# Altium schematic sheet 07_SDDADC.SchDoc
size 420 x 297 mm; SheetNumber: 7; SheetTotal: 12
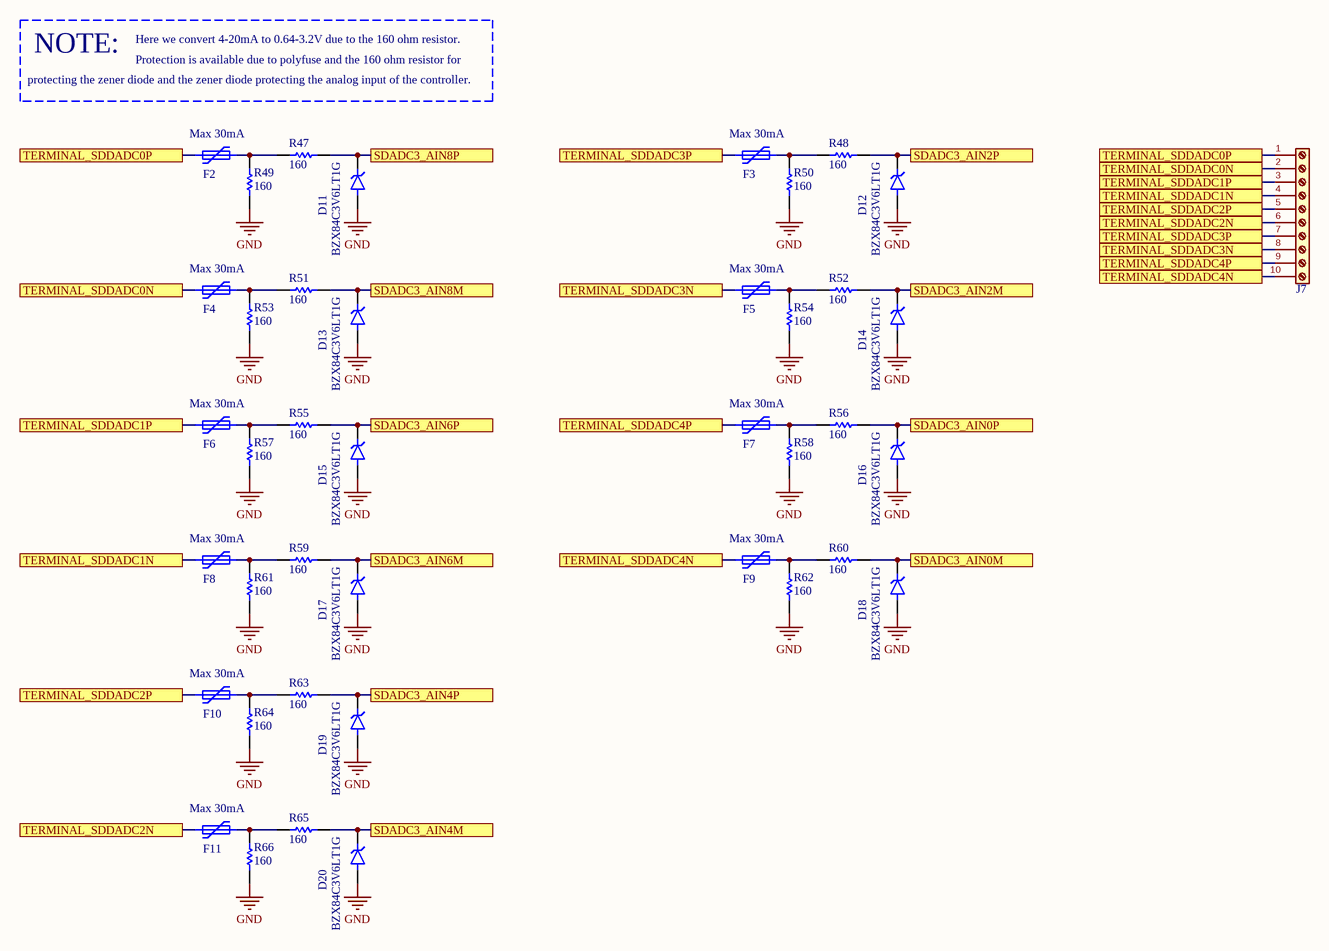
[diagram p0: 07_SDDADC.SchDoc]

## Parts
D11  BZX84C3V6LT1G  [SOT95P240X111-3N]
D12  BZX84C3V6LT1G  [SOT95P240X111-3N]
D13  BZX84C3V6LT1G  [SOT95P240X111-3N]
D14  BZX84C3V6LT1G  [SOT95P240X111-3N]
D15  BZX84C3V6LT1G  [SOT95P240X111-3N]
D16  BZX84C3V6LT1G  [SOT95P240X111-3N]
D17  BZX84C3V6LT1G  [SOT95P240X111-3N]
D18  BZX84C3V6LT1G  [SOT95P240X111-3N]
D19  BZX84C3V6LT1G  [SOT95P240X111-3N]
D20  BZX84C3V6LT1G  [SOT95P240X111-3N]
F2  Max 30mA  [Fuse_0603_1608Metric]
F3  Max 30mA  [Fuse_0603_1608Metric]
F4  Max 30mA  [Fuse_0603_1608Metric]
F5  Max 30mA  [Fuse_0603_1608Metric]
F6  Max 30mA  [Fuse_0603_1608Metric]
F7  Max 30mA  [Fuse_0603_1608Metric]
F8  Max 30mA  [Fuse_0603_1608Metric]
F9  Max 30mA  [Fuse_0603_1608Metric]
F10  Max 30mA  [Fuse_0603_1608Metric]
F11  Max 30mA  [Fuse_0603_1608Metric]
J7  Terminal_01x10_P5.00  [TerminalBlock_Phoenix_PT-1,5-10-5.0-H_1x10_P5.00mm_Horizontal]  (value not drawn)
R47  ValueDisplayed: 160  [0603]  (hidden comment: CRCW060320R0JNEA)
R48  ValueDisplayed: 160  [0603]  (hidden comment: CRCW060320R0JNEA)
R49  ValueDisplayed: 160  [0603]  (hidden comment: CRCW060320R0JNEA)
R50  ValueDisplayed: 160  [0603]  (hidden comment: CRCW060320R0JNEA)
R51  ValueDisplayed: 160  [0603]  (hidden comment: CRCW060320R0JNEA)
R52  ValueDisplayed: 160  [0603]  (hidden comment: CRCW060320R0JNEA)
R53  ValueDisplayed: 160  [0603]  (hidden comment: CRCW060320R0JNEA)
R54  ValueDisplayed: 160  [0603]  (hidden comment: CRCW060320R0JNEA)
R55  ValueDisplayed: 160  [0603]  (hidden comment: CRCW060320R0JNEA)
R56  ValueDisplayed: 160  [0603]  (hidden comment: CRCW060320R0JNEA)
R57  ValueDisplayed: 160  [0603]  (hidden comment: CRCW060320R0JNEA)
R58  ValueDisplayed: 160  [0603]  (hidden comment: CRCW060320R0JNEA)
R59  ValueDisplayed: 160  [0603]  (hidden comment: CRCW060320R0JNEA)
R60  ValueDisplayed: 160  [0603]  (hidden comment: CRCW060320R0JNEA)
R61  ValueDisplayed: 160  [0603]  (hidden comment: CRCW060320R0JNEA)
R62  ValueDisplayed: 160  [0603]  (hidden comment: CRCW060320R0JNEA)
R63  ValueDisplayed: 160  [0603]  (hidden comment: CRCW060320R0JNEA)
R64  ValueDisplayed: 160  [0603]  (hidden comment: CRCW060320R0JNEA)
R65  ValueDisplayed: 160  [0603]  (hidden comment: CRCW060320R0JNEA)
R66  ValueDisplayed: 160  [0603]  (hidden comment: CRCW060320R0JNEA)

## Ports
SDADC3_AIN0M (see 04_STM32F373VBTx[6C]), SDADC3_AIN0P (see 04_STM32F373VBTx[6C]), SDADC3_AIN2M (see 04_STM32F373VBTx[6C]), SDADC3_AIN2P (see 04_STM32F373VBTx[6C]), SDADC3_AIN4M (see 04_STM32F373VBTx[6C]), SDADC3_AIN4P (see 04_STM32F373VBTx[6C]), SDADC3_AIN6M (see 04_STM32F373VBTx[6C]), SDADC3_AIN6P (see 04_STM32F373VBTx[6C]), SDADC3_AIN8M (see 04_STM32F373VBTx[6B]), SDADC3_AIN8P (see 04_STM32F373VBTx[6B]), TERMINAL_SDDADC0N (see 07_SDDADC[1A]), TERMINAL_SDDADC0N (see 07_SDDADC[4A]), TERMINAL_SDDADC0P (see 07_SDDADC[1A]), TERMINAL_SDDADC0P (see 07_SDDADC[4A]), TERMINAL_SDDADC1N (see 07_SDDADC[1B]), TERMINAL_SDDADC1N (see 07_SDDADC[4A]), TERMINAL_SDDADC1P (see 07_SDDADC[1B]), TERMINAL_SDDADC1P (see 07_SDDADC[4A]), TERMINAL_SDDADC2N (see 07_SDDADC[1C]), TERMINAL_SDDADC2N (see 07_SDDADC[4A]), TERMINAL_SDDADC2P (see 07_SDDADC[1B]), TERMINAL_SDDADC2P (see 07_SDDADC[4A]), TERMINAL_SDDADC3N (see 07_SDDADC[2A]), TERMINAL_SDDADC3N (see 07_SDDADC[4A]), TERMINAL_SDDADC3P (see 07_SDDADC[2A]), TERMINAL_SDDADC3P (see 07_SDDADC[4A]), TERMINAL_SDDADC4N (see 07_SDDADC[2B]), TERMINAL_SDDADC4N (see 07_SDDADC[4A]), TERMINAL_SDDADC4P (see 07_SDDADC[2B]), TERMINAL_SDDADC4P (see 07_SDDADC[4A])

## Nets
GND: D11.1(A) D12.1(A) D13.1(A) D14.1(A) D15.1(A) D16.1(A) D17.1(A) D18.1(A) D19.1(A) D20.1(A) R49.1 R50.1 R53.1 R54.1 R57.1 R58.1 R61.1 R62.1 R64.1 R66.1
SDADC3_AIN0M: D18.3(K) R60.2 ; port SDADC3_AIN0M
SDADC3_AIN0P: D16.3(K) R56.2 ; port SDADC3_AIN0P
SDADC3_AIN2M: D14.3(K) R52.2 ; port SDADC3_AIN2M
SDADC3_AIN2P: D12.3(K) R48.2 ; port SDADC3_AIN2P
SDADC3_AIN4M: D20.3(K) R65.2 ; port SDADC3_AIN4M
SDADC3_AIN4P: D19.3(K) R63.2 ; port SDADC3_AIN4P
SDADC3_AIN6M: D17.3(K) R59.2 ; port SDADC3_AIN6M
SDADC3_AIN6P: D15.3(K) R55.2 ; port SDADC3_AIN6P
SDADC3_AIN8M: D13.3(K) R51.2 ; port SDADC3_AIN8M
SDADC3_AIN8P: D11.3(K) R47.2 ; port SDADC3_AIN8P
TERMINAL_SDDADC0N: F4.1 J7.2(Pin_2) ; port TERMINAL_SDDADC0N
TERMINAL_SDDADC0P: F2.1 J7.1(Pin_1) ; port TERMINAL_SDDADC0P
TERMINAL_SDDADC1N: F8.1 J7.4(Pin_4) ; port TERMINAL_SDDADC1N
TERMINAL_SDDADC1P: F6.1 J7.3(Pin_3) ; port TERMINAL_SDDADC1P
TERMINAL_SDDADC2N: F11.1 J7.6(Pin_6) ; port TERMINAL_SDDADC2N
TERMINAL_SDDADC2P: F10.1 J7.5(Pin_5) ; port TERMINAL_SDDADC2P
TERMINAL_SDDADC3N: F5.1 J7.8(Pin_8) ; port TERMINAL_SDDADC3N
TERMINAL_SDDADC3P: F3.1 J7.7(Pin_7) ; port TERMINAL_SDDADC3P
TERMINAL_SDDADC4N: F9.1 J7.10(Pin_10) ; port TERMINAL_SDDADC4N
TERMINAL_SDDADC4P: F7.1 J7.9(Pin_9) ; port TERMINAL_SDDADC4P
NetF2_2: F2.2 R47.1 R49.2
NetF3_2: F3.2 R48.1 R50.2
NetF4_2: F4.2 R51.1 R53.2
NetF5_2: F5.2 R52.1 R54.2
NetF6_2: F6.2 R55.1 R57.2
NetF7_2: F7.2 R56.1 R58.2
NetF8_2: F8.2 R59.1 R61.2
NetF9_2: F9.2 R60.1 R62.2
NetF10_2: F10.2 R63.1 R64.2
NetF11_2: F11.2 R65.1 R66.2

## Notes on the sheet
- Here we convert 4-20mA to 0.64-3.2V due to the 160 ohm resistor.
- protecting the zener diode and the zener diode protecting the analog input of the controller.
- NOTE:
- Protection is available due to polyfuse and the 160 ohm resistor for
- Sub-system:
- Project:
- Design by:
- Sheet title:
- Sheet
- of
- Checked by:
- Approved by:
- Doc No:
- Revision:
- Size:
- Date:
- A3

## Library data of the parts
D11-D20 = BZX84C3V6LT1G: MP: BZX84C10LT1G; Package: None; Price: None; Value: *; Availability: Unavailable
F2-F11 = Polyfuse 0603
R47-R66 = RES 160R 0603: RES, 160, 5%, 0.1 W, AEC-Q200 Grade 0, 0603; Manufacturer: Vishay-Dale; Power_W: 100mW; TempCo: 200 ppm/C; Value_Code: 20R0; Value: 20; EIA_Code: E24; SizeX_mm: 1.6; SizeY_mm: 0.8; SizeZ_mm: 1; Value2: 0.1W; SizeArea_mm2: 1.28; CompType: Resistor; AEC Qualified: Y; VDC_V: 75V; AEC Category: Q200; AEC Grade: 0; Supplier Part Number 2: 59M6784; Supplier 2: Newark; Supplier Part Number 3: 71-CRCW0603J-20-E3; Supplier 3: Mouser; RoHS: E; Value1: 5%; MountType: SMT; Supplier 1: Digi-Key; PackageReference: 0603; Tolerance_%: 5%; Res_ohm: 20; PartNumber: CRCW060320R0JNEA; ComponentLink1Description: Datasheet link; Supplier Part Number 1: 541-20GCT-ND; Technology: Thick Film; ComponentLink1URL: http://www.vishay.com/docs/20035/dcrcwe3.pdf